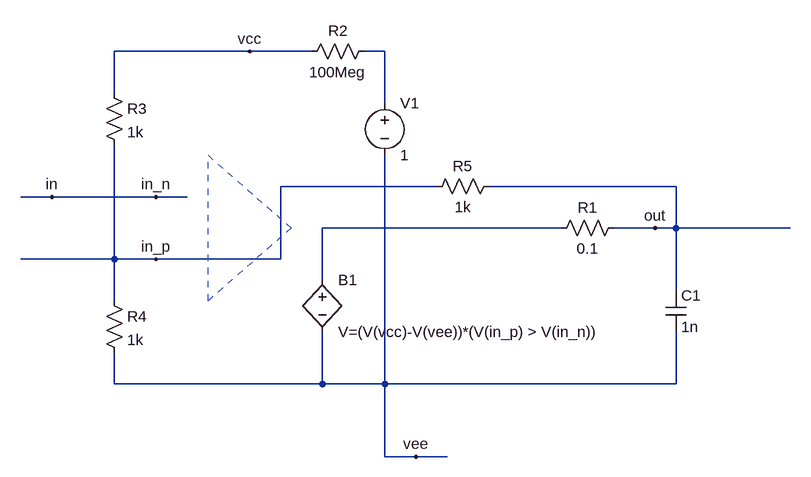
[diagram p0: schematic ideal_schmitt_inv.asc]
ideal_schmitt_inv.asc, the LTspice schematic file:
Version 4
SHEET 1 1880 680
WIRE 64 -208 -144 -208
WIRE 160 -208 64 -208
WIRE 272 -208 240 -208
WIRE -144 -144 -144 -208
WIRE 272 -128 272 -208
WIRE 352 0 112 0
WIRE 720 0 432 0
WIRE -240 16 -288 16
WIRE -80 16 -240 16
WIRE -32 16 -80 16
WIRE 544 64 176 64
WIRE 688 64 624 64
WIRE 720 64 720 0
WIRE 720 64 688 64
WIRE 896 64 720 64
WIRE -144 112 -144 -64
WIRE -144 112 -288 112
WIRE -80 112 -144 112
WIRE 112 112 112 0
WIRE 112 112 -80 112
WIRE 176 144 176 64
WIRE 720 160 720 64
WIRE -144 176 -144 112
WIRE -144 304 -144 256
WIRE 176 304 176 224
WIRE 176 304 -144 304
WIRE 272 304 272 -48
WIRE 272 304 176 304
WIRE 720 304 720 224
WIRE 720 304 272 304
WIRE 272 416 272 304
WIRE 320 416 272 416
WIRE 368 416 320 416
FLAG -80 112 in_p
FLAG -80 16 in_n
FLAG 688 64 out
FLAG 64 -208 vcc
FLAG -240 16 in
FLAG 320 416 vee
SYMBOL bv 176 128 R0
SYMATTR InstName B1
SYMATTR Value V=(V(vcc)-V(vee))*(V(in_p) > V(in_n))
SYMBOL res 640 48 R90
WINDOW 0 0 56 VBottom 2
WINDOW 3 32 56 VTop 2
SYMATTR InstName R1
SYMATTR Value 0.1
SYMBOL cap 704 160 R0
SYMATTR InstName C1
SYMATTR Value 1n
SYMBOL voltage 272 -144 R0
SYMATTR InstName V1
SYMATTR Value 1
SYMBOL res 256 -224 R90
WINDOW 0 0 56 VBottom 2
WINDOW 3 32 56 VTop 2
SYMATTR InstName R2
SYMATTR Value 100Meg
SYMBOL res -160 -160 R0
SYMATTR InstName R3
SYMATTR Value 1k
SYMBOL res -160 160 R0
SYMATTR InstName R4
SYMATTR Value 1k
SYMBOL res 448 -16 R90
WINDOW 0 0 56 VBottom 2
WINDOW 3 32 56 VTop 2
SYMATTR InstName R5
SYMATTR Value 1k
LINE Normal 0 176 0 -48 2
LINE Normal 128 64 0 176 2
LINE Normal 0 -48 128 64 2
LINE Normal 0 -48 0 -48 2

The netlist it stands for:
* ideal_schmitt_inv.asc
B1 N002 vee V=(V(vcc)-V(vee))*(V(in_p) > V(in_n))
R1 out N002 0.1
C1 out vee 1n
V1 N001 vee 1
R2 N001 vcc 100Meg
R3 vcc in_p 1k
R4 in_p vee 1k
R5 out in_p 1k
.backanno
.end